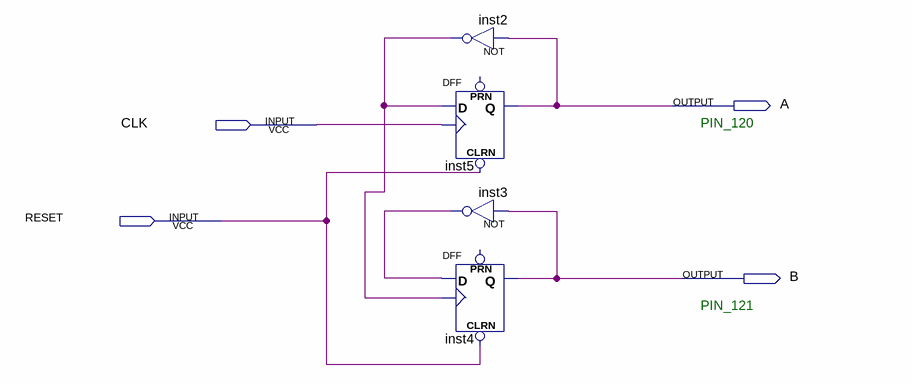
[diagram p0: schematic sheet]
// Quartus schematic Sequencer_2B.bdf as structural Verilog: 4 symbols, 4 pins
module Sequencer_2B (
  input  CLK,
  input  RESET,
  output A,
  output B
);

  wire inst2_out, inst3_out;

  not inst2 (inst2_out, A);
  DFF inst5 (.CLRN(RESET), .CLK(CLK), .D(inst2_out), .Q(A));  // open: PRN
  not inst3 (inst3_out, B);
  DFF inst4 (.CLRN(RESET), .CLK(inst2_out), .D(inst3_out), .Q(B));  // open: PRN

  // Notes on the sheet:
  //   PIN_120
  //   PIN_121
endmodule
